# Altium schematic sheet BMS_Slave_R2.SchDoc
size A4
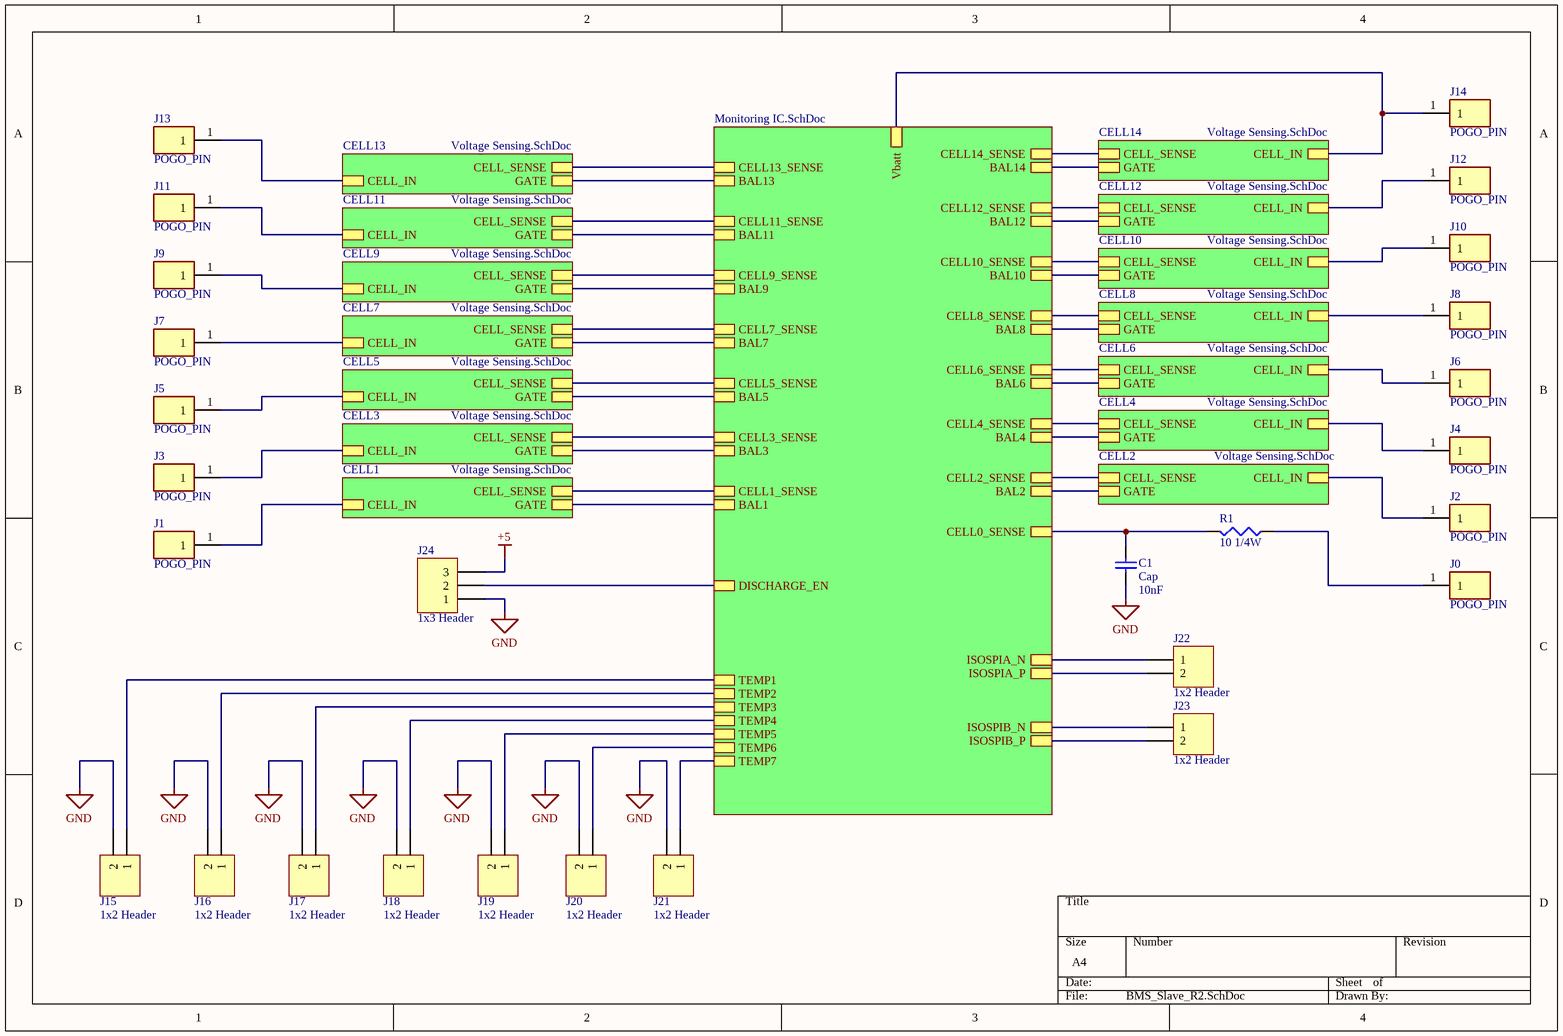
[diagram p0: BMS_Slave_R2.SchDoc]

## Parts
C1  Cap  value 10nF  [0603 - Capacitor]
J0  POGO_PIN  [POGO_PIN]
J1  POGO_PIN  [POGO_PIN]
J2  POGO_PIN  [POGO_PIN]
J3  POGO_PIN  [POGO_PIN]
J4  POGO_PIN  [POGO_PIN]
J5  POGO_PIN  [POGO_PIN]
J6  POGO_PIN  [POGO_PIN]
J7  POGO_PIN  [POGO_PIN]
J8  POGO_PIN  [POGO_PIN]
J9  POGO_PIN  [POGO_PIN]
J10  POGO_PIN  [POGO_PIN]
J11  POGO_PIN  [POGO_PIN]
J12  POGO_PIN  [POGO_PIN]
J13  POGO_PIN  [POGO_PIN]
J14  POGO_PIN  [POGO_PIN]
J15  1x2 Header  [HDR1X2]
J16  1x2 Header  [HDR1X2]
J17  1x2 Header  [HDR1X2]
J18  1x2 Header  [HDR1X2]
J19  1x2 Header  [HDR1X2]
J20  1x2 Header  [HDR1X2]
J21  1x2 Header  [HDR1X2]
J22  1x2 Header  [B2BXH2LFSN]
J23  1x2 Header  [B2BXH2LFSN]
J24  1x3 Header  [HDR1X3]
R1  value 10 1/4W  [0805 - Resistor]  (hidden comment: Res3)

## Sub-sheets
CELL1 = Voltage Sensing.SchDoc: CELL_SENSE, CELL_IN, GATE
CELL2 = Voltage Sensing.SchDoc: CELL_SENSE, CELL_IN, GATE
CELL3 = Voltage Sensing.SchDoc: CELL_SENSE, CELL_IN, GATE
CELL4 = Voltage Sensing.SchDoc: CELL_SENSE, CELL_IN, GATE
CELL5 = Voltage Sensing.SchDoc: CELL_SENSE, CELL_IN, GATE
CELL6 = Voltage Sensing.SchDoc: CELL_SENSE, CELL_IN, GATE
CELL7 = Voltage Sensing.SchDoc: CELL_SENSE, CELL_IN, GATE
CELL8 = Voltage Sensing.SchDoc: CELL_SENSE, CELL_IN, GATE
CELL9 = Voltage Sensing.SchDoc: CELL_SENSE, CELL_IN, GATE
CELL10 = Voltage Sensing.SchDoc: CELL_SENSE, CELL_IN, GATE
CELL11 = Voltage Sensing.SchDoc: CELL_SENSE, CELL_IN, GATE
CELL12 = Voltage Sensing.SchDoc: CELL_SENSE, CELL_IN, GATE
CELL13 = Voltage Sensing.SchDoc: CELL_SENSE, CELL_IN, GATE
CELL14 = Voltage Sensing.SchDoc: CELL_SENSE, CELL_IN, GATE
Designator = Monitoring IC.SchDoc: CELL14_SENSE, BAL14, CELL13_SENSE, BAL13, CELL12_SENSE, BAL12, CELL11_SENSE, BAL11, CELL10_SENSE, BAL10, CELL9_SENSE, BAL9, CELL8_SENSE, BAL8, CELL7_SENSE, BAL7, CELL6_SENSE, BAL6, CELL5_SENSE, BAL5, CELL4_SENSE, BAL4, CELL3_SENSE, BAL3, BAL2, CELL2_SENSE, CELL1_SENSE, BAL1, TEMP3, TEMP4, TEMP2, TEMP1, TEMP5, CELL0_SENSE, DISCHARGE_EN, ISOSPIA_N, ISOSPIB_P, ISOSPIB_N, ISOSPIA_P, Vbatt, TEMP6, TEMP7

## Nets
+5: J24.3
GND: C1.1 J15.2 J16.2 J17.2 J18.2 J19.2 J20.2 J21.2 J24.1
NetC1_2: C1.2 R1.1 ; sheet Designator/CELL0_SENSE
NetJ0_1: J0.1 R1.2
NetJ1_1: J1.1 ; sheet CELL1/CELL_IN
NetJ2_1: J2.1 ; sheet CELL2/CELL_IN
NetJ3_1: J3.1 ; sheet CELL3/CELL_IN
NetJ4_1: J4.1 ; sheet CELL4/CELL_IN
NetJ5_1: J5.1 ; sheet CELL5/CELL_IN
NetJ6_1: J6.1 ; sheet CELL6/CELL_IN
NetJ7_1: J7.1 ; sheet CELL7/CELL_IN
NetJ8_1: J8.1 ; sheet CELL8/CELL_IN
NetJ9_1: J9.1 ; sheet CELL9/CELL_IN
NetJ10_1: J10.1 ; sheet CELL10/CELL_IN
NetJ11_1: J11.1 ; sheet CELL11/CELL_IN
NetJ12_1: J12.1 ; sheet CELL12/CELL_IN
NetJ13_1: J13.1 ; sheet CELL13/CELL_IN
NetJ14_1: J14.1 ; sheet Designator/Vbatt, sheet CELL14/CELL_IN
NetJ15_1: J15.1 ; sheet Designator/TEMP1
NetJ16_1: J16.1 ; sheet Designator/TEMP2
NetJ17_1: J17.1 ; sheet Designator/TEMP3
NetJ18_1: J18.1 ; sheet Designator/TEMP4
NetJ19_1: J19.1 ; sheet Designator/TEMP5
NetJ20_1: J20.1 ; sheet Designator/TEMP6
NetJ21_1: J21.1 ; sheet Designator/TEMP7
NetJ22_1: J22.1 ; sheet Designator/ISOSPIA_N
NetJ22_2: J22.2 ; sheet Designator/ISOSPIA_P
NetJ23_1: J23.1 ; sheet Designator/ISOSPIB_N
NetJ23_2: J23.2 ; sheet Designator/ISOSPIB_P
NetJ24_2: J24.2 ; sheet Designator/DISCHARGE_EN
(unnamed): sheet Designator/CELL14_SENSE, sheet CELL14/CELL_SENSE
(unnamed): sheet Designator/BAL14, sheet CELL14/GATE
(unnamed): sheet Designator/CELL13_SENSE, sheet CELL13/CELL_SENSE
(unnamed): sheet Designator/BAL13, sheet CELL13/GATE
(unnamed): sheet Designator/CELL12_SENSE, sheet CELL12/CELL_SENSE
(unnamed): sheet Designator/BAL12, sheet CELL12/GATE
(unnamed): sheet Designator/CELL11_SENSE, sheet CELL11/CELL_SENSE
(unnamed): sheet Designator/BAL11, sheet CELL11/GATE
(unnamed): sheet Designator/CELL10_SENSE, sheet CELL10/CELL_SENSE
(unnamed): sheet Designator/BAL10, sheet CELL10/GATE
(unnamed): sheet Designator/CELL9_SENSE, sheet CELL9/CELL_SENSE
(unnamed): sheet Designator/BAL9, sheet CELL9/GATE
(unnamed): sheet Designator/CELL8_SENSE, sheet CELL8/CELL_SENSE
(unnamed): sheet Designator/BAL8, sheet CELL8/GATE
(unnamed): sheet Designator/CELL7_SENSE, sheet CELL7/CELL_SENSE
(unnamed): sheet Designator/BAL7, sheet CELL7/GATE
(unnamed): sheet Designator/CELL6_SENSE, sheet CELL6/CELL_SENSE
(unnamed): sheet Designator/BAL6, sheet CELL6/GATE
(unnamed): sheet Designator/CELL5_SENSE, sheet CELL5/CELL_SENSE
(unnamed): sheet Designator/BAL5, sheet CELL5/GATE
(unnamed): sheet Designator/CELL4_SENSE, sheet CELL4/CELL_SENSE
(unnamed): sheet Designator/BAL4, sheet CELL4/GATE
(unnamed): sheet Designator/CELL3_SENSE, sheet CELL3/CELL_SENSE
(unnamed): sheet Designator/BAL3, sheet CELL3/GATE
(unnamed): sheet Designator/BAL2, sheet CELL2/GATE
(unnamed): sheet Designator/CELL2_SENSE, sheet CELL2/CELL_SENSE
(unnamed): sheet Designator/CELL1_SENSE, sheet CELL1/CELL_SENSE
(unnamed): sheet Designator/BAL1, sheet CELL1/GATE

## Library data of the parts
C1 = Cap: Capacitor; Published: 8-Jun-2000; LatestRevisionDate: 17-Jul-2002; LatestRevisionNote: Re-released for DXP Platform.; PackageReference: RAD-0.3; Publisher: Altium Limited; PackageDescription: Radial Cap, Thru-Hole; 2 Leads; 0.3 in Pin Spacing
J0-J14 = POGO_PIN: Pogo Pin
J15-J23 = 1x2 Header: 1x2 Pin Header
J24 = 1x3 Header: 1x3 Pin Header
R1 = Res3: Resistor; Published: 8-Jun-2000; LatestRevisionDate: 29-May-2009; LatestRevisionNote: IPC-7351 Footprint Added.; PackageReference: J1-0603; Publisher: Altium Limited; PackageDescription: Chip Resistor